# Altium schematic sheet Serial IO.SchDoc: Serial I/O Expanders
size Letter; Date: 2017-02-17; Revision: A; SheetNumber: 7; SheetTotal: 11; ProjectTitle: PDUv17: Power Distribution Unit
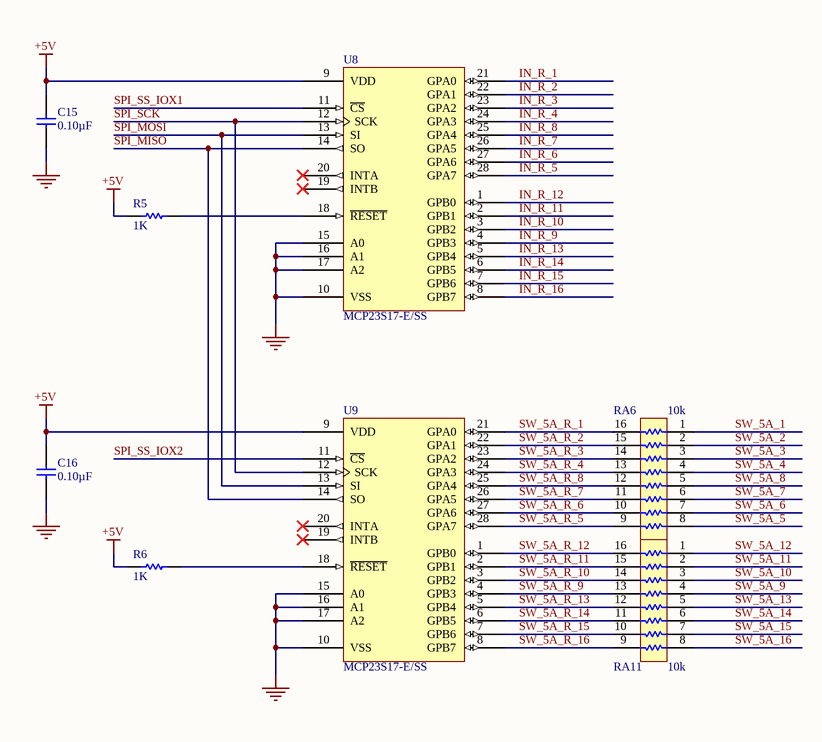
[diagram p0: Serial IO.SchDoc]

## Parts
C15  value 0.10µF  [CAP-0402-M]  (hidden comment: CAP 0.10µF ±10% 16V 0402 X7R)
C16  value 0.10µF  [CAP-0402-M]  (hidden comment: CAP 0.10µF ±10% 16V 0402 X7R)
R5  value 1K  [RES-0603-M]  (hidden comment: RES 1K 1% 1/10 W 0603 ±100ppm/°C)
R6  value 1K  [RES-0603-M]  (hidden comment: RES 1K 1% 1/10 W 0603 ±100ppm/°C)
RA6  value 10k  [CAC-50P379X150-16N]  (hidden comment: MNR18ERAPJ103)
RA11  value 10k  [CAC-50P379X150-16N]  (hidden comment: MNR18ERAPJ103)
U8  MCP23S17-E/SS  [SOP65P780X185-28N]
U9  MCP23S17-E/SS  [SOP65P780X185-28N]

## Nets
+5V: C15.2 C16.2 R5.1 R6.1 U8.9(VDD) U9.9(VDD)
GND: C15.1 C16.1 U8.10(VSS) U8.15(A0) U8.16(A1) U8.17(A2) U9.10(VSS) U9.15(A0) U9.16(A1) U9.17(A2)
IN_R_1: U8.21(GPA0)
IN_R_2: U8.22(GPA1)
IN_R_3: U8.23(GPA2)
IN_R_4: U8.24(GPA3)
IN_R_5: U8.28(GPA7)
IN_R_6: U8.27(GPA6)
IN_R_7: U8.26(GPA5)
IN_R_8: U8.25(GPA4)
IN_R_9: U8.4(GPB3)
IN_R_10: U8.3(GPB2)
IN_R_11: U8.2(GPB1)
IN_R_12: U8.1(GPB0)
IN_R_13: U8.5(GPB4)
IN_R_14: U8.6(GPB5)
IN_R_15: U8.7(GPB6)
IN_R_16: U8.8(GPB7)
SPI_MISO: U8.14(SO) U9.14(SO)
SPI_MOSI: U8.13(SI) U9.13(SI)
SPI_SCK: U8.12(SCK) U9.12(SCK)
SPI_SS_IOX1: U8.11(~{CS})
SPI_SS_IOX2: U9.11(~{CS})
SW_5A_1: RA6.1
SW_5A_2: RA6.2
SW_5A_3: RA6.3
SW_5A_4: RA6.4
SW_5A_5: RA6.8
SW_5A_6: RA6.7
SW_5A_7: RA6.6
SW_5A_8: RA6.5
SW_5A_9: RA11.4
SW_5A_10: RA11.3
SW_5A_11: RA11.2
SW_5A_12: RA11.1
SW_5A_13: RA11.5
SW_5A_14: RA11.6
SW_5A_15: RA11.7
SW_5A_16: RA11.8
SW_5A_R_1: RA6.16 U9.21(GPA0)
SW_5A_R_2: RA6.15 U9.22(GPA1)
SW_5A_R_3: RA6.14 U9.23(GPA2)
SW_5A_R_4: RA6.13 U9.24(GPA3)
SW_5A_R_5: RA6.9 U9.28(GPA7)
SW_5A_R_6: RA6.10 U9.27(GPA6)
SW_5A_R_7: RA6.11 U9.26(GPA5)
SW_5A_R_8: RA6.12 U9.25(GPA4)
SW_5A_R_9: RA11.13 U9.4(GPB3)
SW_5A_R_10: RA11.14 U9.3(GPB2)
SW_5A_R_11: RA11.15 U9.2(GPB1)
SW_5A_R_12: RA11.16 U9.1(GPB0)
SW_5A_R_13: RA11.12 U9.5(GPB4)
SW_5A_R_14: RA11.11 U9.6(GPB5)
SW_5A_R_15: RA11.10 U9.7(GPB6)
SW_5A_R_16: RA11.9 U9.8(GPB7)
NetR5_2: R5.2 U8.18(~{RESET})
NetR6_2: R6.2 U9.18(~{RESET})

Not connected (* = marked no-connect by the designer): U8 19(INTB)* 20(INTA)*; U9 19(INTB)* 20(INTA)*

## Notes on the sheet
- Date:
- Revision:
- Sheet:
- /

## Library data of the parts
C15 C16 = CC0402KRX7R7BB104: Manufacturer: Yageo; Manufacturer Series: CC; Part Number: CC0402KRX7R7BB104; Component Type: Standard; Tolerance: ±10%; Voltage: 16V; Package: 0402; Temperature Coefficient: X7R; Temperature Range: -55°C ~ 125°C; Supplier 1: Digi-Key; Supplier Part Number 1: 311-1338-1-ND
R5 R6 = RC0603FR-071KL: Manufacturer: Yageo; Manufacturer Series: RC; Power: 1/10 W; Part Number: RC0603FR-071KL; Component Type: Standard; Tolerance: 1%; Package: 0603; Temperature Coefficient: ±100ppm/°C; Temperature Range: -55°C ~ 155°C; Supplier 1: Digi-Key; Supplier Part Number 1: 311-1.00KHRCT-ND